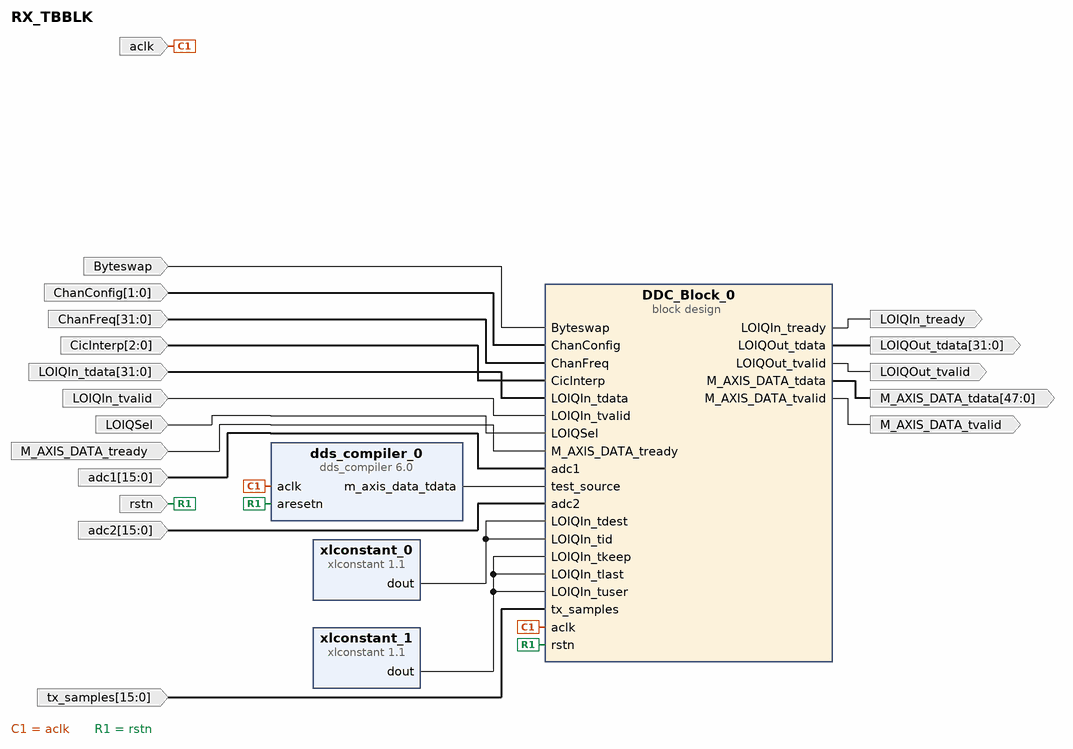
[diagram p0: block diagram of the top level]
# Vivado block design RX_TBBLK, xc7a200tfbg676-2, Vivado 2021.2
create_bd_design RX_TBBLK

create_bd_port -dir I -type clk aclk
set_property -dict {CONFIG.FREQ_HZ 122880000} [get_bd_ports aclk]
create_bd_port -dir I rstn
create_bd_port -dir I -from 31 -to 0 ChanFreq
create_bd_port -dir I -from 1 -to 0 ChanConfig
create_bd_port -dir I -from 2 -to 0 CicInterp
create_bd_port -dir I -from 15 -to 0 adc1
create_bd_port -dir I -from 15 -to 0 adc2
create_bd_port -dir I -from 15 -to 0 tx_samples
create_bd_port -dir I -from 31 -to 0 LOIQIn_tdata
create_bd_port -dir I LOIQIn_tvalid
create_bd_port -dir O LOIQIn_tready
create_bd_port -dir I LOIQSel
create_bd_port -dir I Byteswap
create_bd_port -dir O LOIQOut_tvalid
create_bd_port -dir O -from 47 -to 0 M_AXIS_DATA_tdata
create_bd_port -dir O M_AXIS_DATA_tvalid
create_bd_port -dir I M_AXIS_DATA_tready
create_bd_port -dir O -from 31 -to 0 LOIQOut_tdata

create_bd_cell -type ip -vlnv xilinx.com:ip:dds_compiler:6.0 dds_compiler_0
set_property -dict [list \
  CONFIG.DDS_Clock_Rate 122.88 \
  CONFIG.Frequency_Resolution 0.05 \
  CONFIG.Has_ARESETn true \
  CONFIG.Has_Phase_Out false \
  CONFIG.Latency 8 \
  CONFIG.M_DATA_Has_TUSER Not_Required \
  CONFIG.Noise_Shaping Auto \
  CONFIG.Output_Frequency1 2.0 \
  CONFIG.Output_Selection Sine \
  CONFIG.Output_Width 16 \
  CONFIG.PINC1 100001010101010101010101010 \
  CONFIG.Phase_Width 32 \
  CONFIG.Spurious_Free_Dynamic_Range 96 \
] [get_bd_cells dds_compiler_0]
create_bd_cell -type container -reference DDC_Block DDC_Block_0
set_property -dict [list \
  CONFIG.ACTIVE_SIM_BD DDC_Block.bd \
  CONFIG.ACTIVE_SYNTH_BD DDC_Block.bd \
  CONFIG.ENABLE_DFX 0 \
  CONFIG.LIST_SIM_BD DDC_Block.bd \
  CONFIG.LIST_SYNTH_BD DDC_Block.bd \
  CONFIG.LOCK_PROPAGATE 0 \
] [get_bd_cells DDC_Block_0]
create_bd_cell -type ip -vlnv xilinx.com:ip:xlconstant:1.1 xlconstant_0
set_property -dict {CONFIG.CONST_VAL 0 CONFIG.CONST_WIDTH 8} [get_bd_cells xlconstant_0]
create_bd_cell -type ip -vlnv xilinx.com:ip:xlconstant:1.1 xlconstant_1
set_property -dict {CONFIG.CONST_VAL 0} [get_bd_cells xlconstant_1]

# ---- connections ----

connect_bd_net [get_bd_ports Byteswap] [get_bd_pins DDC_Block_0/Byteswap]
connect_bd_net [get_bd_ports ChanConfig] [get_bd_pins DDC_Block_0/ChanConfig]
connect_bd_net [get_bd_ports ChanFreq] [get_bd_pins DDC_Block_0/ChanFreq]
connect_bd_net [get_bd_ports CicInterp] [get_bd_pins DDC_Block_0/CicInterp]
connect_bd_net [get_bd_pins DDC_Block_0/LOIQIn_tready] [get_bd_ports LOIQIn_tready]
connect_bd_net [get_bd_pins DDC_Block_0/LOIQOut_tdata] [get_bd_ports LOIQOut_tdata]
connect_bd_net [get_bd_pins DDC_Block_0/LOIQOut_tvalid] [get_bd_ports LOIQOut_tvalid]
connect_bd_net [get_bd_pins DDC_Block_0/M_AXIS_DATA_tdata] [get_bd_ports M_AXIS_DATA_tdata]
connect_bd_net [get_bd_pins DDC_Block_0/M_AXIS_DATA_tvalid] [get_bd_ports M_AXIS_DATA_tvalid]
connect_bd_net [get_bd_ports LOIQIn_tdata] [get_bd_pins DDC_Block_0/LOIQIn_tdata]
connect_bd_net [get_bd_ports LOIQIn_tvalid] [get_bd_pins DDC_Block_0/LOIQIn_tvalid]
connect_bd_net [get_bd_ports LOIQSel] [get_bd_pins DDC_Block_0/LOIQSel]
connect_bd_net [get_bd_ports M_AXIS_DATA_tready] [get_bd_pins DDC_Block_0/M_AXIS_DATA_tready]
connect_bd_net [get_bd_ports aclk] [get_bd_pins dds_compiler_0/aclk] [get_bd_pins DDC_Block_0/aclk]
connect_bd_net -net adc1_1 [get_bd_ports adc1] [get_bd_pins DDC_Block_0/adc1]
connect_bd_net -net adc2_1 [get_bd_ports adc2] [get_bd_pins DDC_Block_0/adc2]
connect_bd_net [get_bd_pins dds_compiler_0/m_axis_data_tdata] [get_bd_pins DDC_Block_0/test_source]
connect_bd_net [get_bd_ports rstn] [get_bd_pins dds_compiler_0/aresetn] [get_bd_pins DDC_Block_0/rstn]
connect_bd_net [get_bd_ports tx_samples] [get_bd_pins DDC_Block_0/tx_samples]
connect_bd_net [get_bd_pins xlconstant_0/dout] [get_bd_pins DDC_Block_0/LOIQIn_tdest] [get_bd_pins DDC_Block_0/LOIQIn_tid]
connect_bd_net [get_bd_pins xlconstant_1/dout] \
  [get_bd_pins DDC_Block_0/LOIQIn_tkeep] [get_bd_pins DDC_Block_0/LOIQIn_tlast] [get_bd_pins DDC_Block_0/LOIQIn_tuser]

validate_bd_design
save_bd_design
